# EAGLE design PIC32 (EAGLE 9.6.2)
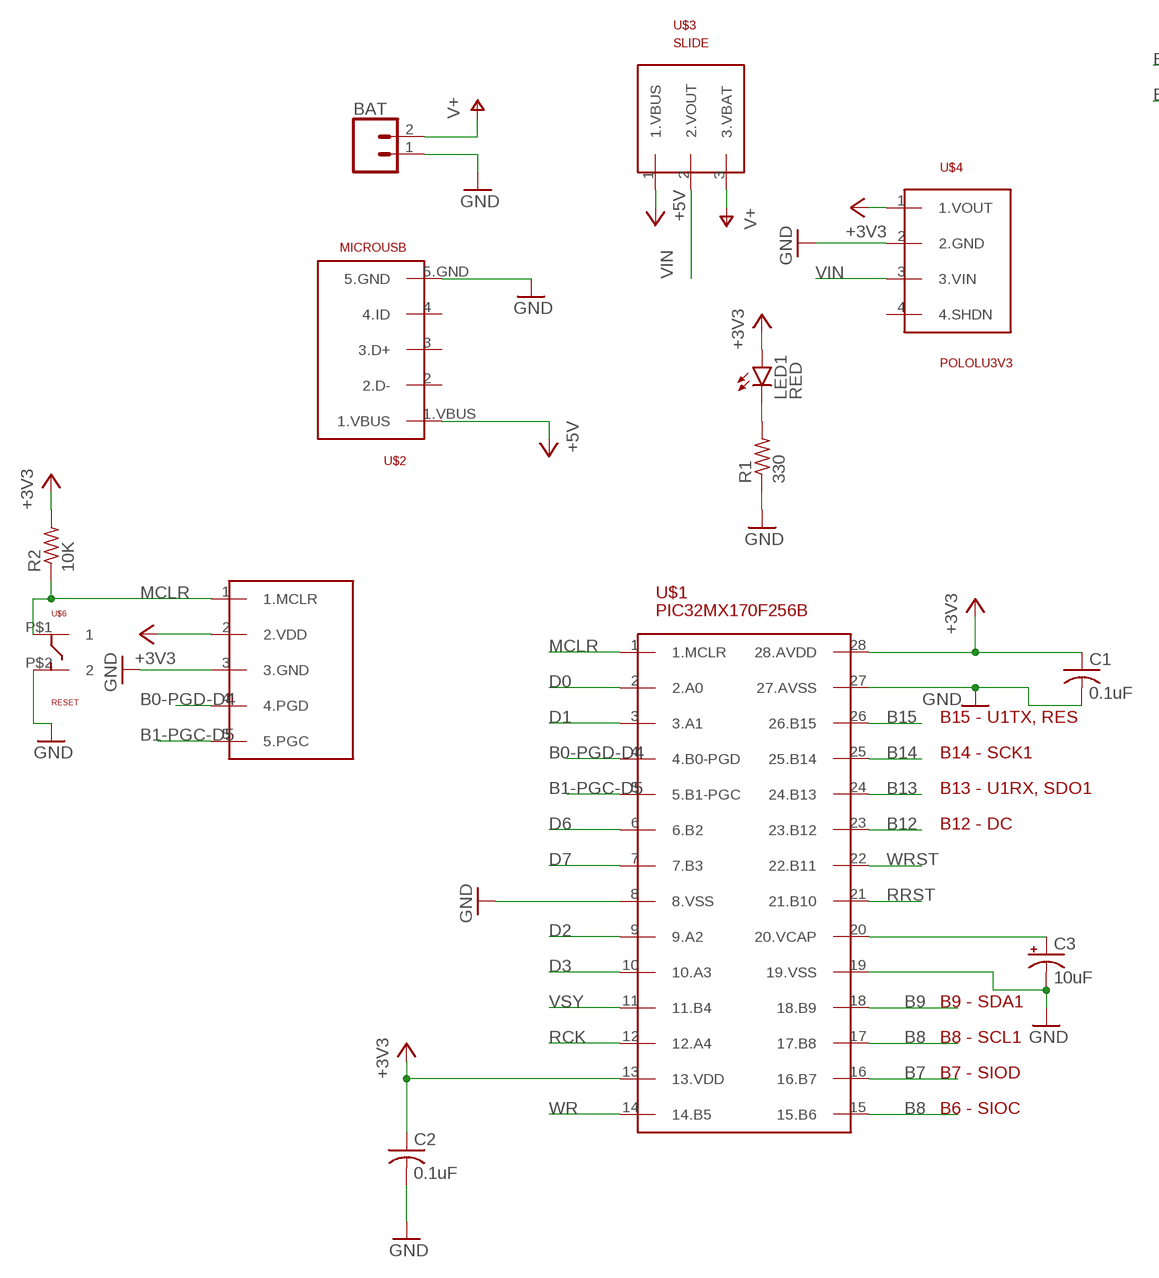
[diagram p0: schematic, sheet 1, part 1 of 2]
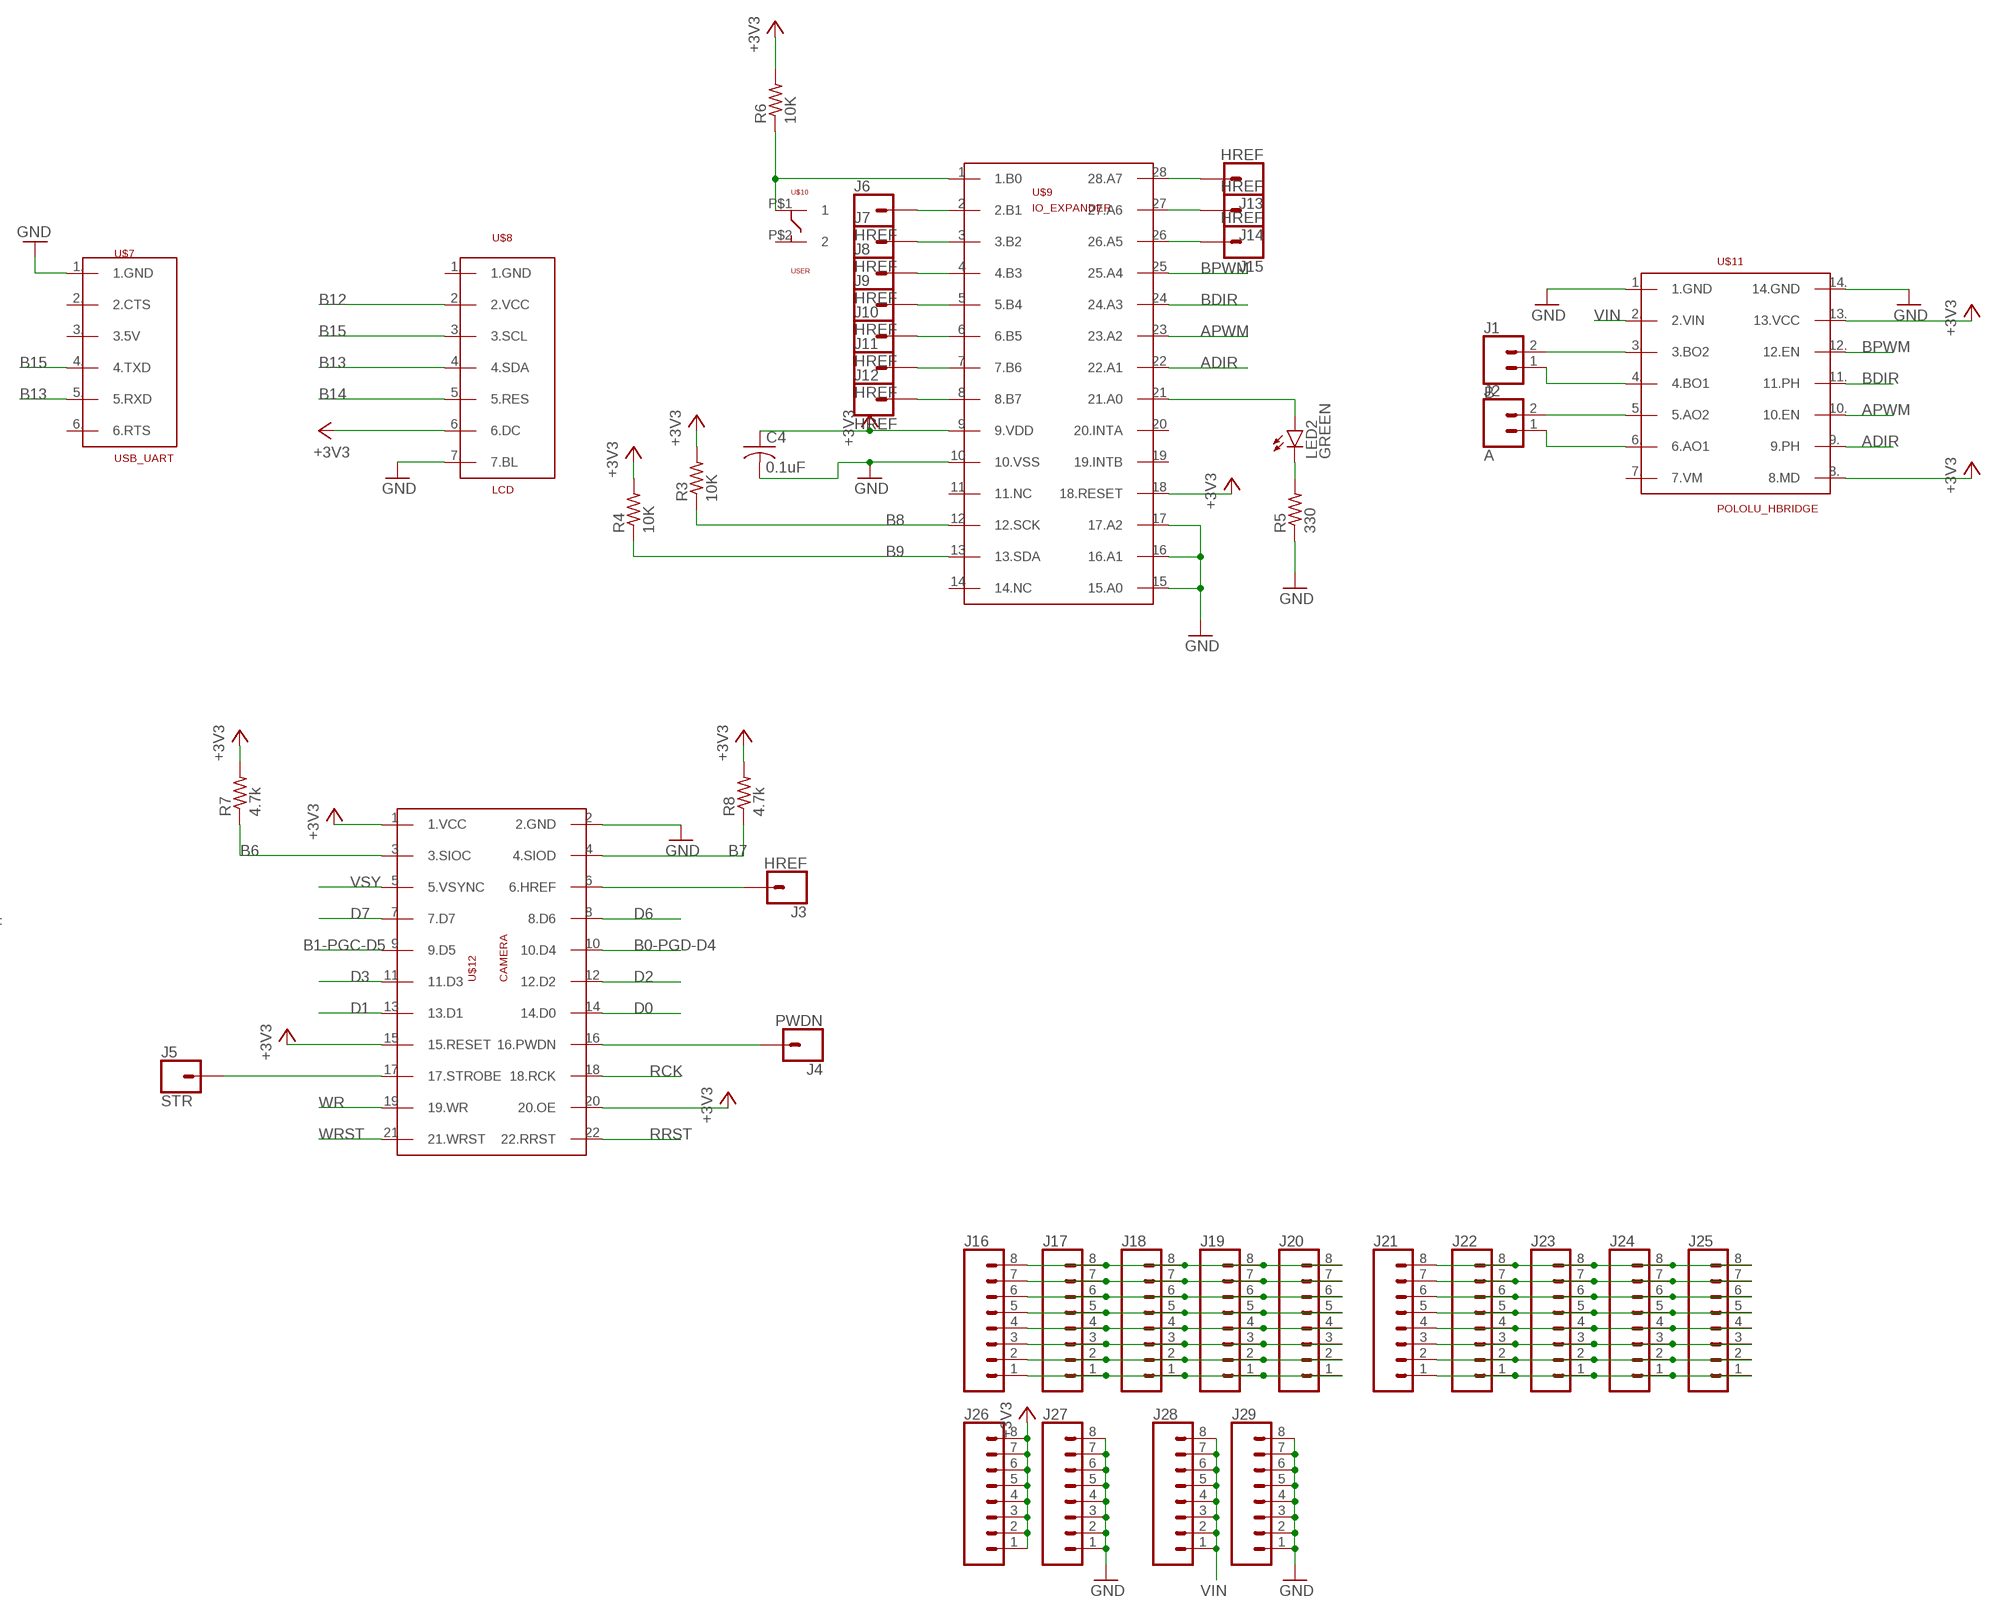
[diagram p1: schematic, sheet 1, part 2 of 2]

## Parts
BAT  CONN_02  [1X02]
C1  0.1uF  C-US025-025X050  [C025-025X050]
C2  0.1uF  C-US025-025X050  [C025-025X050]
C3  10uF  CPOL-USB45181B  [B45181B]
C4  0.1uF  C-US025-025X050  [C025-025X050]
J1  B  CONN_02  [1X02]
J2  A  CONN_02  [1X02]
J3  HREF  CONN_01  [1X01]
J4  PWDN  CONN_01  [1X01]
J5  STR  CONN_01  [1X01]
J6  HREF  CONN_01  [1X01]
J7  HREF  CONN_01  [1X01]
J8  HREF  CONN_01  [1X01]
J9  HREF  CONN_01  [1X01]
J10  HREF  CONN_01  [1X01]
J11  HREF  CONN_01  [1X01]
J12  HREF  CONN_01  [1X01]
J13  HREF  CONN_01  [1X01]
J14  HREF  CONN_01  [1X01]
J15  HREF  CONN_01  [1X01]
J16  CONN_08"  [1X08]
J17  CONN_08"  [1X08]
J18  CONN_08"  [1X08]
J19  CONN_08"  [1X08]
J20  CONN_08"  [1X08]
J21  CONN_08"  [1X08]
J22  CONN_08"  [1X08]
J23  CONN_08"  [1X08]
J24  CONN_08"  [1X08]
J25  CONN_08"  [1X08]
J26  CONN_08"  [1X08]
J27  CONN_08"  [1X08]
J28  CONN_08"  [1X08]
J29  CONN_08"  [1X08]
LED1  RED  LED3MM  [LED3MM]
LED2  GREEN  LED3MM  [LED3MM]
R1  330  R-US_0207/10  [0207/10]
R2  10K  R-US_0207/10  [0207/10]
R3  10K  R-US_0207/10  [0207/10]
R4  10K  R-US_0207/10  [0207/10]
R5  330  R-US_0207/10  [0207/10]
R6  10K  R-US_0207/10  [0207/10]
R7  4.7k  R-US_0207/10  [0207/10]
R8  4.7k  R-US_0207/10  [0207/10]
U$1  PIC32MX170F256B  [DIL28-3]
U$2  MICROUSB  [MICROUSB]
U$3  SLIDE  [SLIDE]
U$4  POLOLU3V3  [POLOLU3V3]
U$5  SNAP  [SNAP]
U$6  RESET  PUSH  [PUSH]
U$7  USB_UART  [USB_UART]
U$8  LCD  [LCD]
U$9  IO_EXPANDER  [DIL28-3]
U$10  USER  PUSH  [PUSH]
U$11  POLOLU_HBRIDGE  [POLOLU_HBRIDGE]
U$12  CAMERA  [CAMERA]

## Nets
+3V3: C1.1 C2.1 C4.1 J26.1 J26.2 J26.3 J26.4 J26.5 J26.6 J26.7 J26.8 LED1.A R2.2 R3.2 R4.2 R6.2 R7.2 R8.2 U$1.13(13.VDD) U$1.28(28.AVDD) U$4.1(1.VOUT) U$5.2(2.VDD) U$8.6.(6.DC) U$9.9(9.VDD) U$9.18(18.RESET) U$11.8.(8.MD) U$11.13.(13.VCC) U$12.1(1.VCC) U$12.15(15.RESET) U$12.20(20.OE)
+5V: U$2.1.VBUS U$3.1(1.VBUS)
ADIR: U$9.22(22.A1) U$11.9.(9.PH)
APWM: U$9.23(23.A2) U$11.10.(10.EN)
B0-PGD-D4: U$1.4(4.B0-PGD) U$5.4(4.PGD) U$12.10(10.D4)
B1-PGC-D5: U$1.5(5.B1-PGC) U$5.5(5.PGC) U$12.9(9.D5)
B6: R7.1 U$12.3(3.SIOC)
B7: R8.1 U$1.16(16.B7) U$12.4(4.SIOD)
B8: R3.1 U$1.15(15.B6) U$1.17(17.B8) U$9.12(12.SCK)
B9: R4.1 U$1.18(18.B9) U$9.13(13.SDA)
B12: U$1.23(23.B12) U$8.2.(2.VCC)
B13: U$1.24(24.B13) U$7.5.(5.RXD) U$8.4.(4.SDA)
B14: U$1.25(25.B14) U$8.5.(5.RES)
B15: U$1.26(26.B15) U$7.4.(4.TXD) U$8.3.(3.SCL)
BDIR: U$9.24(24.A3) U$11.11.(11.PH)
BPWM: U$9.25(25.A4) U$11.12.(12.EN)
D0: U$1.2(2.A0) U$12.14(14.D0)
D1: U$1.3(3.A1) U$12.13(13.D1)
D2: U$1.9(9.A2) U$12.12(12.D2)
D3: U$1.10(10.A3) U$12.11(11.D3)
D6: U$1.6(6.B2) U$12.8(8.D6)
D7: U$1.7(7.B3) U$12.7(7.D7)
GND: BAT.1 C1.2 C2.2 C3.- C4.2 J27.1 J27.2 J27.3 J27.4 J27.5 J27.6 J27.7 J27.8 J29.1 J29.2 J29.3 J29.4 J29.5 J29.6 J29.7 J29.8 R1.1 R5.1 U$1.8(8.VSS) U$1.19(19.VSS) U$1.27(27.AVSS) U$2.5.GND U$4.2(2.GND) U$5.3(3.GND) U$6.P$2 U$7.1.(1.GND) U$8.7.(7.BL) U$9.10(10.VSS) U$9.15(15.A0) U$9.16(16.A1) U$9.17(17.A2) U$11.1.(1.GND) U$11.14.(14.GND) U$12.2(2.GND)
MCLR: R2.1 U$1.1(1.MCLR) U$5.1(1.MCLR) U$6.P$1
N$1: LED1.K(C) R1.2
N$2: C3.+ U$1.20(20.VCAP)
N$3: R6.1 U$9.1(1.B0) U$10.P$1
N$4: J1.2 U$11.3.(3.BO2)
N$5: LED2.A U$9.21(21.A0)
N$6: LED2.K(C) R5.2
N$7: J1.1 U$11.4.(4.BO1)
N$8: J2.2 U$11.5.(5.AO2)
N$9: J2.1 U$11.6.(6.AO1)
N$10: J5.1 U$12.17(17.STROBE)
N$11: J4.1 U$12.16(16.PWDN)
N$12: J3.1 U$12.6(6.HREF)
N$13: J6.1 U$9.2(2.B1)
N$14: J7.1 U$9.3(3.B2)
N$15: J8.1 U$9.4(4.B3)
N$16: J9.1 U$9.5(5.B4)
N$17: J10.1 U$9.6(6.B5)
N$18: J11.1 U$9.7(7.B6)
N$19: J12.1 U$9.8(8.B7)
N$20: J15.1 U$9.26(26.A5)
N$21: J14.1 U$9.27(27.A6)
N$22: J13.1 U$9.28(28.A7)
N$23: J16.8 J17.8 J18.8 J19.8 J20.8
N$25: J16.7 J17.7 J18.7 J19.7 J20.7
N$26: J16.6 J17.6 J18.6 J19.6 J20.6
N$27: J16.5 J17.5 J18.5 J19.5 J20.5
N$28: J16.4 J17.4 J18.4 J19.4 J20.4
N$29: J16.3 J17.3 J18.3 J19.3 J20.3
N$30: J16.2 J17.2 J18.2 J19.2 J20.2
N$31: J16.1 J17.1 J18.1 J19.1 J20.1
N$32: J21.8 J22.8 J23.8 J24.8 J25.8
N$33: J21.7 J22.7 J23.7 J24.7 J25.7
N$34: J21.6 J22.6 J23.6 J24.6 J25.6
N$35: J21.5 J22.5 J23.5 J24.5 J25.5
N$36: J21.4 J22.4 J23.4 J24.4 J25.4
N$37: J21.3 J22.3 J23.3 J24.3 J25.3
N$38: J21.2 J22.2 J23.2 J24.2 J25.2
N$39: J21.1 J22.1 J23.1 J24.1 J25.1
RCK: U$1.12(12.A4) U$12.18(18.RCK)
RRST: U$1.21(21.B10) U$12.22(22.RRST)
V+: BAT.2 U$3.3(3.VBAT)
VIN: J28.1 J28.2 J28.3 J28.4 J28.5 J28.6 J28.7 J28.8 U$3.2(2.VOUT) U$4.3(3.VIN) U$11.2.(2.VIN)
VSY: U$1.11(11.B4) U$12.5(5.VSYNC)
WR: U$1.14(14.B5) U$12.19(19.WR)
WRST: U$1.22(22.B11) U$12.21(21.WRST)
Unconnected: U$2.2(2.D-) U$2.3(3.D+) U$2.4(4.ID) U$4.4(4.SHDN) U$7.2.(2.CTS) U$7.3.(3.5V) U$7.6.(6.RTS) U$8.1.(1.GND) U$9.11(11.NC) U$9.14(14.NC) U$9.19(19.INTB) U$9.20(20.INTA) U$10.P$2 U$11.7.(7.VM)

## Notes on the sheet
- B15 - U1TX, RES
- B14 - SCK1
- B13 - U1RX, SDO1
- B12 - DC
- B9 - SDA1
- B8 - SCL1
- B7 - SIOD
- B6 - SIOC

## Library data of the parts
BAT J1 J2 = PIC32:CONN_02: Multi connection point. Often used as Generic Header-pin footprint for 0.1 inch spaced/style header connections On any of the 0.1 inch spaced packages, you can populate with these: Break Away Headers - Straight <https://www.sparkfun.com/products/116> (PRT-00116) Break Away Male Headers - Right Angle <https://www.sparkfun.com/products/553> (PRT-00553) Female Headers <https://www.sparkfun.com/products/115> (PRT-00115) Break Away Headers - Machine Pin <https://www.sparkfun.com/products/117> (PRT-00117) Break Away Female Headers - Swiss Machine Pin <https://www.sparkfun.com/products/743> (PRT-00743) For SCREWTERMINALS and SPRING TERMINALS visit here: Screw Terimnals on SparkFun.com <https://www.sparkfun.com/search/results?term=Screw+Terminals> (5mm/3.5mm/2.54mm spacing) This device is also useful as a general connection point to wire up your design to another part of your project. Our various solder wires solder well into these plated through hole pads. Hook-Up Wire - Assortment (Stranded, 22 AWG) <https://www.sparkfun.com/products/11375> (PRT-11375) Hook-Up Wire - Assortment (Solid Core, 22 AWG) <https://www.sparkfun.com/products/11367> (PRT-11367) View the entire wire category on our website here <https://www.sparkfun.com/categories/141> Special notes: Molex polarized connector foot print use with: PRT-08233 with associated crimp pins and housings. 2.54_SCREWTERM for use with PRT-10571. 3.5mm Screw Terminal footprints for PRT-08084 5mm Screw Terminal footprints for use with PRT-08432
C1 C2 C4 = PIC32:C-US: CAPACITOR, American symbol; SPICEPREFIX: C
C3 = PIC32:CPOL-US: POLARIZED CAPACITOR, American symbol; SPICEPREFIX: C
J3-J15 = PIC32:CONN_01: Single connection point. Often used as Generic Header-pin footprint for 0.1 inch spaced/style header connections On any of the 0.1 inch spaced packages, you can populate with these: Break Away Headers - Straight <https://www.sparkfun.com/products/116> (PRT-00116) Break Away Male Headers - Right Angle <https://www.sparkfun.com/products/553> (PRT-00553) Female Headers <https://www.sparkfun.com/products/115> (PRT-00115) Break Away Headers - Machine Pin <https://www.sparkfun.com/products/117> (PRT-00117) Break Away Female Headers - Swiss Machine Pin <https://www.sparkfun.com/products/743> (PRT-00743) This device is also useful as a general connection point to wire up your design to another part of your project. Our various solder wires solder well into these plated through hole pads. Hook-Up Wire - Assortment (Stranded, 22 AWG) <https://www.sparkfun.com/products/11375> (PRT-11375) Hook-Up Wire - Assortment (Solid Core, 22 AWG) <https://www.sparkfun.com/products/11367> (PRT-11367) View the entire wire category on our website here <https://www.sparkfun.com/categories/141> Special notes: SMTSO-256-ET is a "flush mount" nut for a 4-40 screw. We mostly use this on specialty testbeds; it is a nice way to connect hardware to your PCB at an adjustable hieght. Also note, the SNAP packages are for using a snappable style connector. We sell a baggie of snaps and they are also used on two LilyPad designs: Snap Assortment - 30 pack (male and female) <https://www.sparkfun.com/products/11347> (DEV-11347) LilyPad Arduino SimpleSnap <https://www.sparkfun.com/products/10941> (DEV-10941) LilyPad SimpleSnap Protoboard <https://www.sparkfun.com/products/10940> (DEV-10940)
J16-J29 = PIC32:CONN_08: Multi connection point. Often used as Generic Header-pin footprint for 0.1 inch spaced/style header connections On any of the 0.1 inch spaced packages, you can populate with these: Break Away Headers - Straight <https://www.sparkfun.com/products/116> (PRT-00116) Break Away Male Headers - Right Angle <https://www.sparkfun.com/products/553> (PRT-00553) Female Headers <https://www.sparkfun.com/products/115> (PRT-00115) Break Away Headers - Machine Pin <https://www.sparkfun.com/products/117> (PRT-00117) Break Away Female Headers - Swiss Machine Pin <https://www.sparkfun.com/products/743> (PRT-00743) Arduino Stackable Header - 8 Pin <https://www.sparkfun.com/products/9279> (PRT-09279) For SCREWTERMINALS and SPRING TERMINALS visit here: Screw Terimnals on SparkFun.com <https://www.sparkfun.com/search/results?term=Screw+Terminals> (5mm/3.5mm/2.54mm spacing) This device is also useful as a general connection point to wire up your design to another part of your project. Our various solder wires solder well into these plated through hole pads. Hook-Up Wire - Assortment (Stranded, 22 AWG) <https://www.sparkfun.com/products/11375> (PRT-11375) Hook-Up Wire - Assortment (Solid Core, 22 AWG) <https://www.sparkfun.com/products/11367> (PRT-11367) View the entire wire category on our website here <https://www.sparkfun.com/categories/141> Special notes: Molex polarized connector foot print use with SKU : PRT-08231 with associated crimp pins and housings. 1MM SMD Version SKU: PRT-10208 NOTES ON THE VARIANTS LOCK and LOCK_LONGPADS... This footprint was designed to help hold the alignment of a through-hole component (i.e. 6-pin header) while soldering it into place. You may notice that each hole has been shifted either up or down by 0.005 of an inch from it's more standard position (which is a perfectly straight line). This slight alteration caused the pins (the squares in the middle) to touch the edges of the holes. Because they are alternating, it causes a "brace" to hold the component in place. 0.005 has proven to be the perfect amount of "off-center" position when using our standard breakaway headers. Although looks a little odd when you look at the bare footprint, once you have a header in there, the alteration is very hard to notice. Also,if you push a header all the way into place, it is covered up entirely on the bottom side.; PROD_ID: CONN-08438
LED1 LED2 = PIC32:LED: LED OSRAM: - CHIPLED LG R971, LG N971, LY N971, LG Q971, LY Q971, LO R971, LY R971 LH N974, LH R974 LS Q976, LO Q976, LY Q976 LO Q996 - Hyper CHIPLED LW Q18S LB Q993, LB Q99A, LB R99A - SideLED LS A670, LO A670, LY A670, LG A670, LP A670 LB A673, LV A673, LT A673, LW A673 LH A674 LY A675 LS A676, LA A676, LO A676, LY A676, LW A676 LS A679, LY A679, LG A679 - Hyper Micro SIDELED® LS Y876, LA Y876, LO Y876, LY Y876 LT Y87S - SmartLED LW L88C, LW L88S LB L89C, LB L89S, LG L890 LS L89K, LO L89K, LY L89K LS L896, LA L896, LO L896, LY L896 - TOPLED LS T670, LO T670, LY T670, LG T670, LP T670 LSG T670, LSP T670, LSY T670, LOP T670, LYG T670 LG T671, LOG T671, LSG T671 LB T673, LV T673, LT T673, LW T673 LH T674 LS T676, LA T676, LO T676, LY T676, LB T676, LH T676, LSB T676, LW T676 LB T67C, LV T67C, LT T67C, LS T67K, LO T67K, LY T67K, LW E67C LS E67B, LA E67B, LO E67B, LY E67B, LB E67C, LV E67C, LT E67C LW T67C LS T679, LY T679, LG T679 LS T770, LO T770, LY T770, LG T770, LP T770 LB T773, LV T773, LT T773, LW T773 LH T774 LS E675, LA E675, LY E675, LS T675 LS T776, LA T776, LO T776, LY T776, LB T776 LHGB T686 LT T68C, LB T68C - Hyper Mini TOPLED® LB M676 - Mini TOPLED Santana® LG M470 LS M47K, LO M47K, LY M47K Source: http://www.osram.convergy.de LUXEON: - LUMILED® LXK2-PW12-R00, LXK2-PW12-S00, LXK2-PW14-U00, LXK2-PW14-V00 LXK2-PM12-R00, LXK2-PM12-S00, LXK2-PM14-U00 LXK2-PE12-Q00, LXK2-PE12-R00, LXK2-PE12-S00, LXK2-PE14-T00, LXK2-PE14-U00 LXK2-PB12-K00, LXK2-PB12-L00, LXK2-PB12-M00, LXK2-PB14-N00, LXK2-PB14-P00, LXK2-PB14-Q00 LXK2-PR12-L00, LXK2-PR12-M00, LXK2-PR14-Q00, LXK2-PR14-R00 LXK2-PD12-Q00, LXK2-PD12-R00, LXK2-PD12-S00 LXK2-PH12-R00, LXK2-PH12-S00 LXK2-PL12-P00, LXK2-PL12-Q00, LXK2-PL12-R00 Source: www.luxeon.com KINGBRIGHT: KA-3528ASYC Source: www.kingbright.com
R1-R8 = PIC32:R-US_: RESISTOR, American symbol; SPICEPREFIX: R
U$1 = PIC32:PIC32MX170F256B
U$2 = PIC32:MICROUSB
U$3 = PIC32:SLIDE
U$4 = PIC32:POLOLU3V3
U$5 = PIC32:SNAP
U$6 U$10 = PIC32:PUSH
U$7 = PIC32:USB_UART
U$8 = PIC32:LCD
U$9 = PIC32:IO_EXPANDER
U$11 = PIC32:POLOLU_HBRIDGE
U$12 = PIC32:CAMERA

## Board
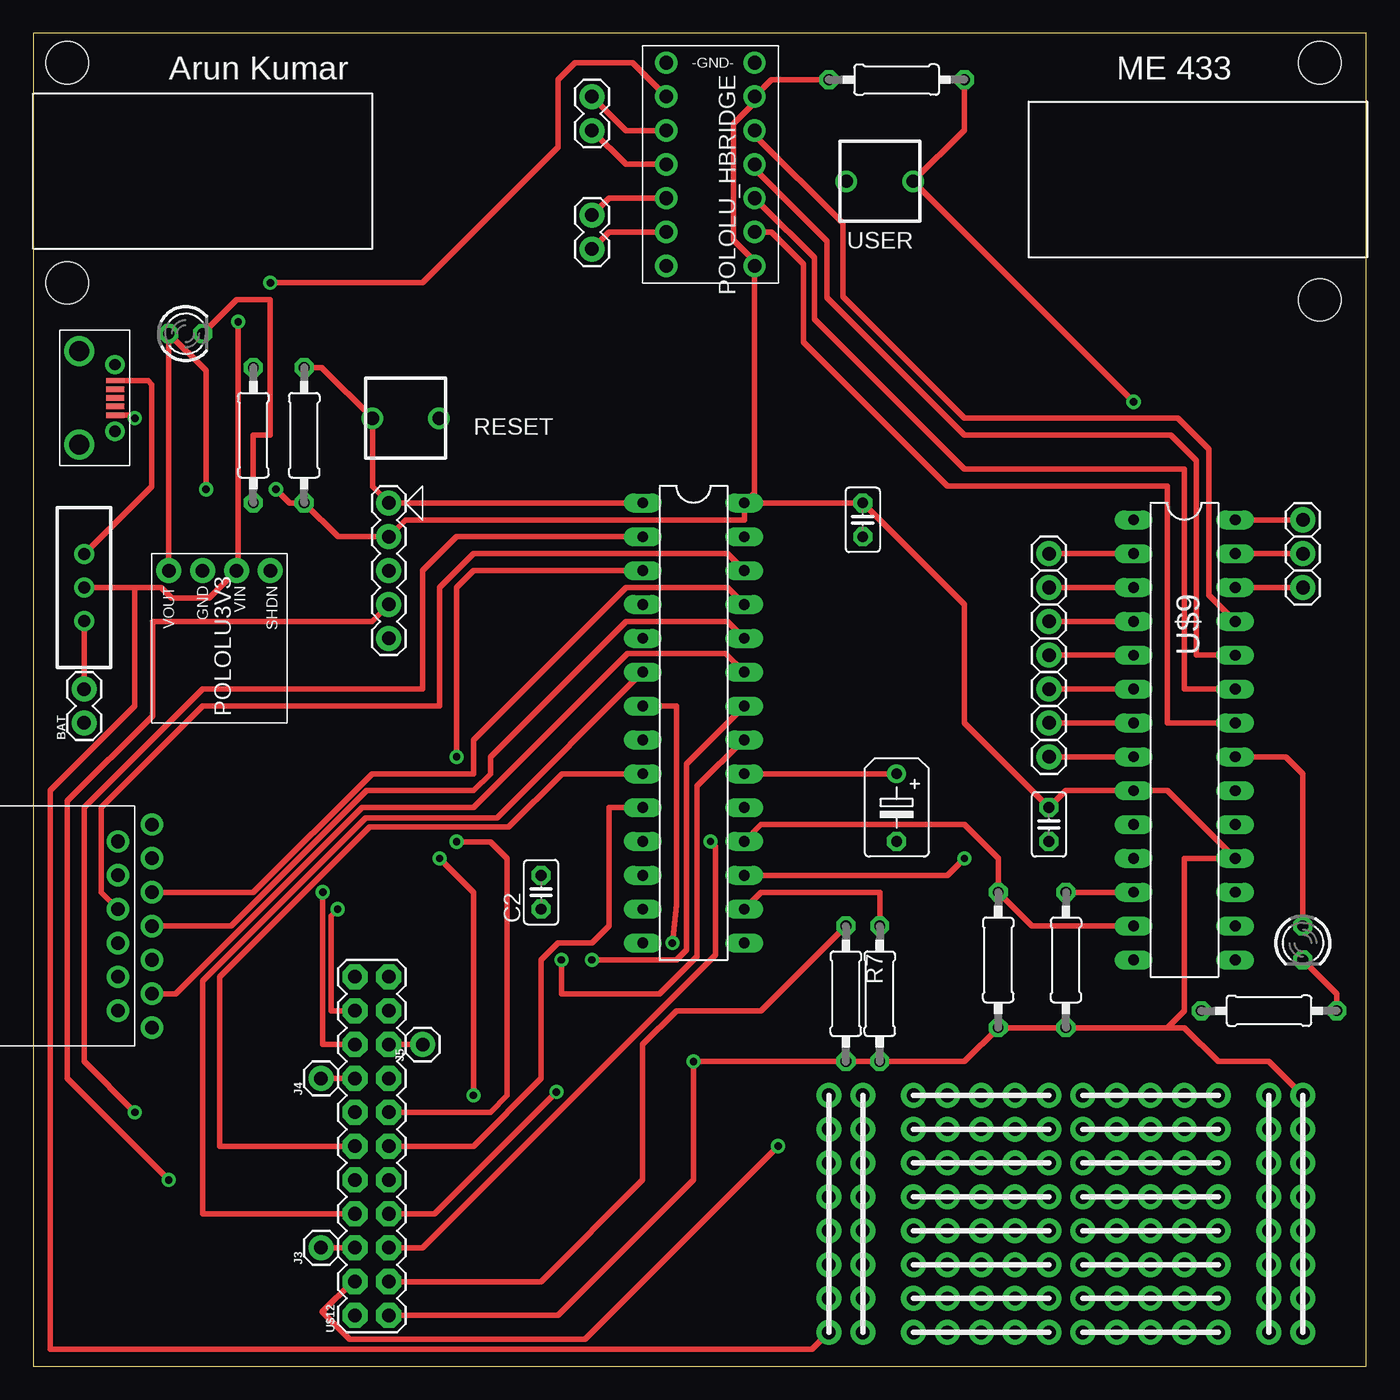
[diagram p2: board, top side]
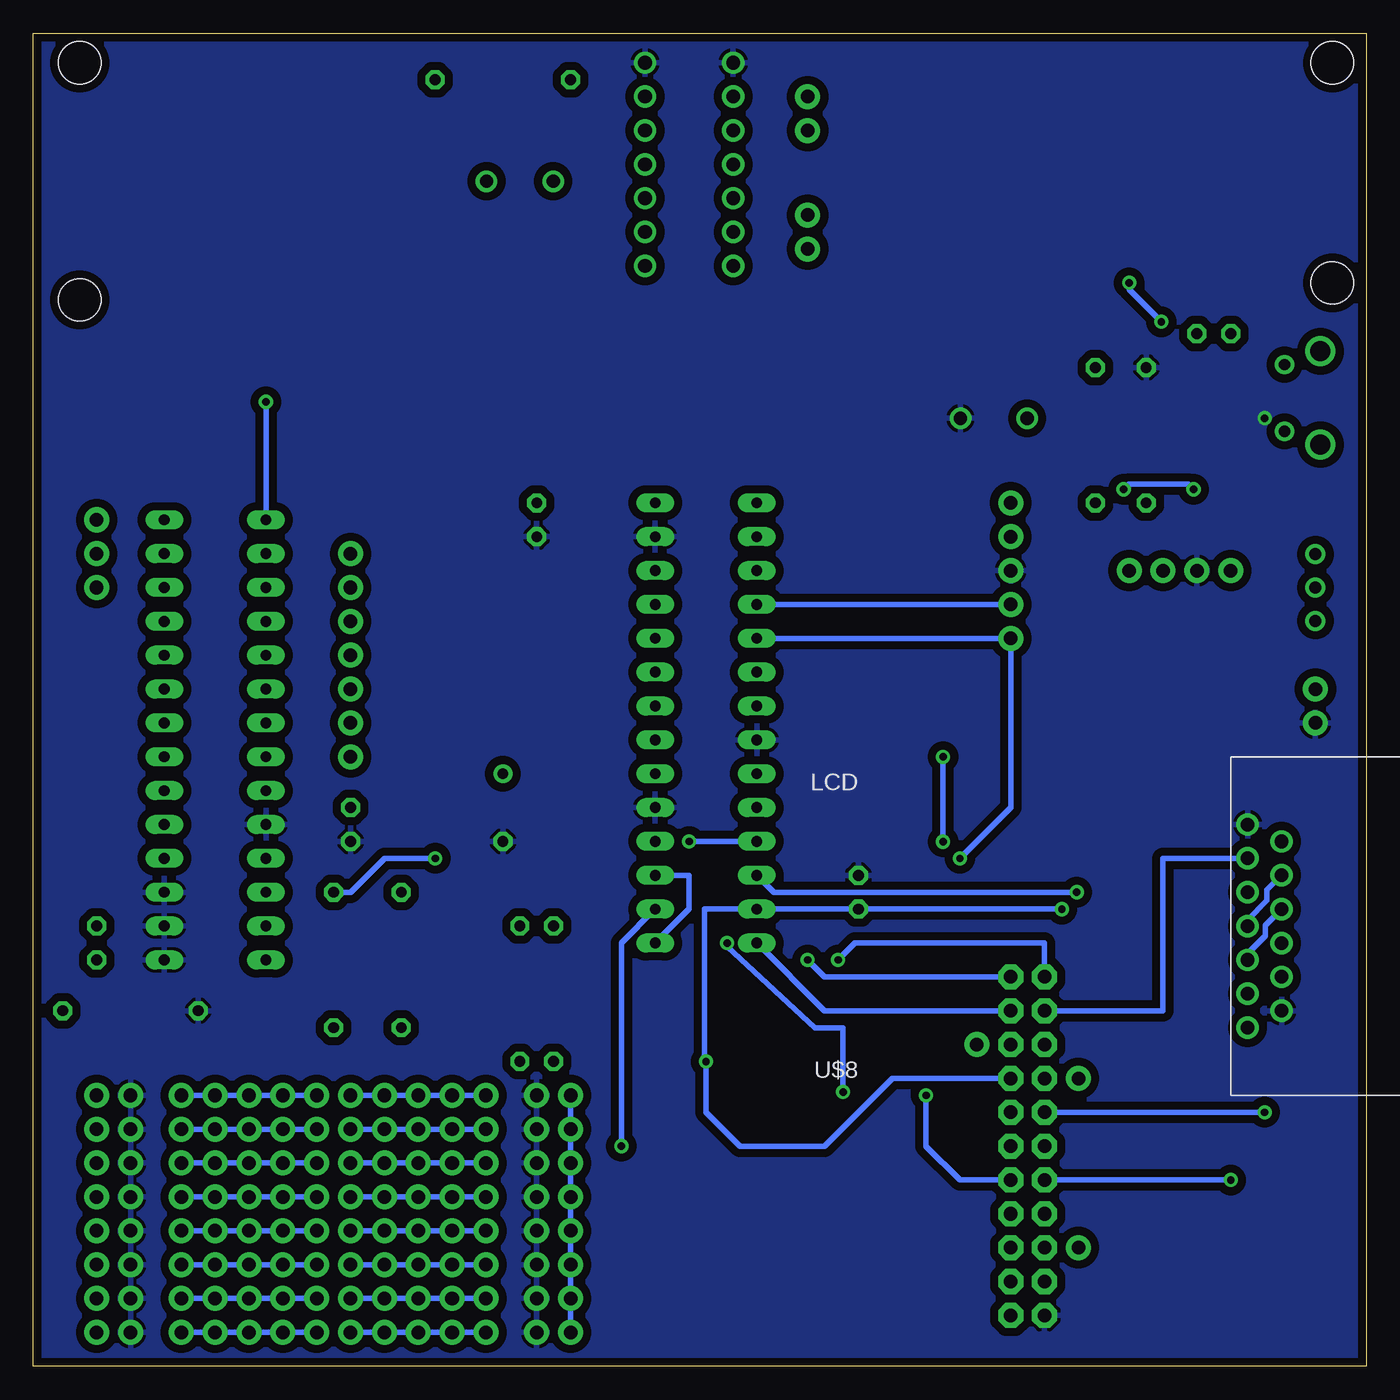
[diagram p3: board, bottom side, seen from below]

Size 100 x 100 mm. Coordinates in mm from the lower left corner, seen from the top.
Outline: 0,0 100,0 100,100 0,100 0,0
Copper layers (1*16): Top 0.035mm / dielectric 1.5mm / Bottom 0.035mm
Design rules "SparkFun": minimum track width 8mil, minimum drill 20mil, track to track 8mil, track to pad 8mil, pad to pad 8mil, via to via 8mil, smd to smd 8mil, copper to edge 8mil, drill to drill 8mil, minimum pad ring 12mil, minimum via ring 10mil, stop-mask expansion 4mil, vias tented up to drill 20mil, thermal gap 10mil
Holes 3.17 mm at 2.54,97.79 2.54,81.28 96.52,97.79 96.52,80.01

### Footprints (pad centres in the part's own frame; a part is rotated, then mirrored left to right if it is on the bottom)
1X02 = drill 1.016 pad 1.88: 1 0,0; 2 2.54,0
C025-025X050 = drill 0.813 octagon: 1 -1.27,0; 2 1.27,0
B45181B = drill 0.813: + -2.54,0 | drill 0.813 octagon: - 2.54,0
1X01 = drill 1.016 pad 1.88: 1 0,0
1X08 = drill 1.016 pad 1.88: 1 0,0; 2 2.54,0; 3 5.08,0; 4 7.62,0; 5 10.16,0; 6 12.7,0; 7 15.24,0; 8 17.78,0
LED3MM = drill 0.813 octagon: A -1.27,0; K 1.27,0
0207/10 = drill 0.813 octagon: 1 -5.08,0; 2 5.08,0
DIL28-3 = drill 0.813 long: 1 -16.51,-3.81; 2 -13.97,-3.81; 3 -11.43,-3.81; 4 -8.89,-3.81; 5 -6.35,-3.81; 6 -3.81,-3.81; 7 -1.27,-3.81; 8 1.27,-3.81; 9 3.81,-3.81; 10 6.35,-3.81; 11 8.89,-3.81; 12 11.43,-3.81; 13 13.97,-3.81; 14 16.51,-3.81; 15 16.51,3.81; 16 13.97,3.81; 17 11.43,3.81; 18 8.89,3.81; 19 6.35,3.81; 20 3.81,3.81; 21 1.27,3.81; 22 -1.27,3.81; 23 -3.81,3.81; 24 -6.35,3.81; 25 -8.89,3.81; 26 -11.43,3.81; 27 -13.97,3.81; 28 -16.51,3.81
MICROUSB = smd 0.4 x 1.35: 1.VBUS -1.3,2.7; 2 -0.65,2.7; 3 0,2.7; 4 0.64,2.7; 5.GND 1.3,2.7 | drill 0.85: P$6 -2.5,2.7; P$7 2.5,2.7 | drill 1.5: P$8 -3.5,0; P$9 3.5,0
SLIDE = drill 0.9: 1 -2.5,0; 2 0,0; 3 2.5,0
POLOLU3V3 = drill 1.016 pad 1.88: 1 0,3.81; 2 0,1.27; 3 0,-1.27; 4 0,-3.81
SNAP = drill 1.016 pad 1.88: 1 0,5.08; 2 0,2.54; 3 0,0; 4 0,-2.54; 5 0,-5.08
PUSH = drill 1: P$1 -2.5,0; P$2 2.5,0
USB_UART = drill 1.02 pad 1.676: 1. -5.08,6.35; 2. -5.08,3.81; 3. -5.08,1.27; 4. -5.08,-1.27; 5. -5.08,-3.81; 6. -5.08,-6.35
LCD = drill 1.02 pad 1.676: 1. -6.35,7.62; 2. -6.35,5.08; 3. -6.35,2.54; 4. -6.35,0; 5. -6.35,-2.54; 6. -6.35,-5.08; 7. -6.35,-7.62
POLOLU_HBRIDGE = drill 1.02 pad 1.676: 1. -3.31,7.62; 2. -3.31,5.08; 3. -3.31,2.54; 4. -3.31,0; 5. -3.31,-2.54; 6. -3.31,-5.08; 7. -3.31,-7.62; 8. 3.31,-7.62; 9. 3.31,-5.08; 10. 3.31,-2.54; 11. 3.31,0; 12. 3.31,2.54; 13. 3.31,5.08; 14. 3.31,7.62
CAMERA = drill 1.016 pad 1.88 octagon: 1 -1.27,12.7; 2 1.27,12.7; 3 -1.27,10.16; 4 1.27,10.16; 5 -1.27,7.62; 6 1.27,7.62; 7 -1.27,5.08; 8 1.27,5.08; 9 -1.27,2.54; 10 1.27,2.54; 11 -1.27,0; 12 1.27,0; 13 -1.27,-2.54; 14 1.27,-2.54; 15 -1.27,-5.08; 16 1.27,-5.08; 17 -1.27,-7.62; 18 1.27,-7.62; 19 -1.27,-10.16; 20 1.27,-10.16; 21 -1.27,-12.7; 22 1.27,-12.7

### Placement (x,y rotation side)
BAT  3.81,48.26 90 top
C1  62.23,63.5 270 top
C2  38.1,35.56 90 top
C3  64.77,41.91 270 top
C4  76.2,40.64 270 top
J1  41.91,92.71 90 top
J2  41.91,83.82 90 top
J3  21.59,8.89 90 top
J4  21.59,21.59 90 top
J5  29.21,24.13 90 top
J6  76.2,60.96 90 top
J7  76.2,58.42 90 top
J8  76.2,55.88 90 top
J9  76.2,53.34 90 top
J10  76.2,50.8 90 top
J11  76.2,48.26 90 top
J12  76.2,45.72 90 top
J13  95.25,63.5 90 top
J14  95.25,60.96 90 top
J15  95.25,58.42 90 top
J16  66.04,2.54 90 top
J17  68.58,2.54 90 top
J18  71.12,2.54 90 top
J19  73.66,2.54 90 top
J20  76.2,2.54 90 top
J21  78.74,2.54 90 top
J22  81.28,2.54 90 top
J23  83.82,2.54 90 top
J24  86.36,2.54 90 top
J25  88.9,2.54 90 top
J26  95.25,2.54 90 top
J27  62.23,2.54 90 top
J28  59.69,2.54 90 top
J29  92.71,2.54 90 top
LED1  11.43,77.47 0 top
LED2  95.25,31.75 270 top
R1  16.51,69.85 270 top
R2  20.32,69.85 270 top
R3  77.47,30.48 270 top
R4  72.39,30.48 270 top
R5  92.71,26.67 0 top
R6  64.77,96.52 180 top
R7  60.96,27.94 270 top
R8  63.5,27.94 270 top
U$1  49.53,48.26 270 top
U$2  3.43,72.64 270 top
U$3  3.81,58.42 270 top
U$4  13.97,59.69 90 top
U$5  26.67,59.69 0 top
U$6  27.94,71.12 0 top
U$7  1.27,33.02 180 top
U$8  15.24,33.02 180 bottom
U$9  86.36,46.99 270 top
U$10  63.5,88.9 180 top
U$11  50.8,90.17 0 top
U$12  25.4,16.51 180 top

### Tracks (layer width: path | path; a pad name or v marks a point on that pad's centre or on a via)
+3V3  (via drill 0.55)
  Top 0.406: U$4.1 LED1.A 12.95,74.68 v12.95,65.79 | U$1.28 53.34,63.5 27.94,63.5 U$5.2 22.86,62.23 R2.2 19.22,64.77 v18.2,65.79 | U$1.28 C1.1 69.85,57.15 69.85,48.26 C4.1 77.47,43.18 U$9.9 85.09,43.18 U$9.18 86.36,38.1 86.36,26.67 85.09,25.4 | U$1.28 54.11,65.54 U$11.8. 54.11,82.89 52.53,84.47 52.53,93.2 54.11,94.78 U$11.13. 55.38,96.52 R6.2 | 85.09,25.4 R3.2 R4.2 69.85,22.86 R8.2 R7.2 v49.53,22.86 49.53,13.97 39.37,3.81 U$12.1 | J26.1 J26.2 J26.3 J26.4 J26.5 J26.6 J26.7 J26.8 92.71,22.86 88.9,22.86 86.36,25.4 85.09,25.4 | v22.84,34.29 22.33,33.78 22.33,26.67 U$12.20
  Bottom 0.406: v12.95,65.79 13.34,66.17 17.82,66.17 v18.2,65.79 | U$8.6. 15.24,38.1 15.24,26.67 U$12.20 | v22.84,34.29 C2.1 U$1.13 49.66,34.29 49.66,22.99 v49.53,22.86 49.53,19.05 46.99,16.51 40.64,16.51 35.56,21.59 U$12.15
+5V
  Top 0.406: U$2.1.VBUS 8.61,73.94 8.89,73.66 8.89,66 U$3.1
ADIR
  Top 0.406: U$9.22 85.09,48.26 85.09,66.04 68.58,66.04 57.78,76.83 57.78,82.68 55.37,85.09 U$11.9.
APWM
  Top 0.406: U$9.23 86.36,50.8 86.36,67.31 69.85,67.31 58.6,78.56 58.6,83.16 54.61,87.15 54.61,87.63 U$11.10.
B0-PGD-D4  (via drill 0.55)
  Top 0.406: U$5.4 25.4,55.88 8.94,55.88 8.94,48.79 2.54,42.39 2.54,21.59 v10.16,13.97
  Bottom 0.406: U$5.4 U$1.4 | v10.16,13.97 U$12.10
B1-PGC-D5  (via drill 0.55)
  Top 0.406: v30.48,38.1 33.02,35.56 v33.02,20.32
  Bottom 0.406: U$1.5 U$5.5 26.67,41.91 v30.48,38.1 | v33.02,20.32 33.02,16.51 30.48,13.97 U$12.9
B6
  Top 0.406: U$12.3 38.1,6.35 45.72,13.97 45.72,24.13 48.26,26.67 54.61,26.67 R7.1
B7  (via drill 0.55)
  Top 0.406: R8.1 63.5,35.56 54.61,35.56 U$1.16 | v55.88,16.51 41.38,2.01 23.72,2.01 21.66,4.06 23.95,6.35 U$12.4
  Bottom 0.406: U$1.16 55.88,31.75 v55.88,16.51
B8  (via drill 0.55)
  Top 0.406: U$9.12 R3.1 | v69.85,38.1 68.58,36.83 U$1.17
  Bottom 0.406: R3.1 76.2,35.56 73.66,38.1 v69.85,38.1 | U$1.17 50.8,36.83 50.8,34.29 U$1.15
B9
  Top 0.406: U$1.18 54.61,40.64 69.85,40.64 72.39,38.1 R4.1 74.93,33.02 U$9.13
B12
  Top 0.406: U$1.23 51.94,53.47 44.58,53.47 33.02,41.91 24.67,41.91 10.7,27.94 U$8.2.
B13
  Top 0.406: U$1.24 52.07,55.88 44.45,55.88 34.29,45.72 34.29,44.45 33.02,43.18 25.02,43.18 14.86,33.02 U$8.4.
  Bottom 0.406: U$7.5. 7.44,35.74 7.44,34.94 8.89,33.49 U$8.4.
B14
  Top 0.406: U$1.25 52.07,58.42 44.45,58.42 33.02,46.99 33.02,44.45 25.4,44.45 16.51,35.56 U$8.5.
B15
  Top 0.406: U$1.26 52.07,60.96 33.02,60.96 30.48,58.42 30.48,49.53 12.7,49.53 5.08,41.91 5.08,35.56 U$7.4.
  Bottom 0.406: U$7.4. 7.57,33.07 7.57,32.27 8.89,30.95 U$8.3.
BDIR
  Top 0.406: U$9.24 87.25,53.34 87.25,67.94 85.34,69.85 69.85,69.85 59.54,80.16 59.54,84.4 54.11,89.83 U$11.11.
BPWM
  Top 0.406: U$9.25 88.19,57.86 88.19,68.81 85.88,71.12 69.85,71.12 60.73,80.24 60.73,85.75 54.11,92.37 U$11.12.
D0  (via drill 0.55)
  Top 0.406: U$1.2 31.75,62.23 29.21,59.69 29.21,50.8 12.7,50.8 3.81,41.91 3.81,22.86 v7.62,19.05
  Bottom 0.406: v7.62,19.05 U$12.14
D1  (via drill 0.55)
  Top 0.406: U$1.3 33.02,59.69 31.75,58.42 v31.75,45.72 | v31.75,39.35 34.31,39.35 35.56,38.1 35.56,20.32 34.29,19.05 U$12.13
  Bottom 0.406: v31.75,45.72 v31.75,39.35
D2
  Top 0.406: U$1.9 39.65,44.45 35.66,40.46 25.22,40.46 13.97,29.21 13.97,16.51 U$12.12
D3
  Top 0.406: U$12.11 33.02,16.51 38.1,21.59 38.1,30.48 39.37,31.75 41.91,31.75 43.18,33.02 43.18,41.91 U$1.10
D6
  Top 0.406: U$1.6 34.8,41.15 24.95,41.15 12.7,28.9 12.7,11.43 U$12.8
D7  (via drill 0.55)
  Top 0.406: U$1.7 48.26,49.53 48.26,34.62 v47.94,31.75 | v39.24,20.57 30.1,11.43 U$12.7
  Bottom 0.406: v47.94,31.75 47.94,31.51 41.34,25.4 39.24,25.4 v39.24,20.57
GND  (via drill 0.55)
  Top 0.406: U$2.5.GND 7.4,71.34 v7.62,71.12
  pour Bottom (isolate 0.61): 0,0 100.33,0 100.33,100.33 0,100.33
MCLR
  Top 0.406: U$1.1 U$5.1 25.44,66 U$6.P$1 21.63,74.93 R2.1
N$1
  Top 0.406: LED1.K 15.24,80.01 17.78,80.01 17.78,69.85 16.51,69.85 R1.2
N$2
  Top 0.406: U$1.20 C3.+
N$3  (via drill 0.55)
  Top 0.406: R6.1 69.85,92.75 U$10.P$1 v82.55,72.35
  Bottom 0.406: v82.55,72.35 U$9.1
N$4
  Top 0.406: U$11.3. 44.45,92.71 J1.2
N$5
  Top 0.406: U$9.21 93.98,45.72 95.25,44.45 LED2.A
N$6
  Top 0.406: LED2.K 97.79,27.94 R5.2
N$7
  Top 0.406: U$11.4. 44.45,90.17 J1.1
N$8
  Top 0.406: U$11.5. 43.18,87.63 J2.2
N$9
  Top 0.406: U$11.6. 43.18,85.09 J2.1
N$10
  Top 0.406: J5.1 U$12.17
N$11
  Top 0.406: J4.1 U$12.16
N$12
  Top 0.406: J3.1 U$12.6
N$13
  Top 0.406: U$9.2 J6.1
N$14
  Top 0.406: U$9.3 J7.1
N$15
  Top 0.406: J8.1 U$9.4
N$16
  Top 0.406: U$9.5 J9.1
N$17
  Top 0.406: J10.1 U$9.6
N$18
  Top 0.406: U$9.7 J11.1
N$19
  Top 0.406: J12.1 U$9.8
N$20
  Top 0.406: U$9.26 J15.1
N$21
  Top 0.406: U$9.27 J14.1
N$22
  Top 0.406: U$9.28 J13.1
N$23
  Bottom 0.406: J16.8 J17.8 J18.8 J19.8 J20.8
N$25
  Bottom 0.406: J16.7 J17.7 J18.7 J19.7 J20.7
N$26
  Bottom 0.406: J16.6 J17.6 J18.6 J19.6 J20.6
N$27
  Bottom 0.406: J16.5 J17.5 J18.5 J19.5 J20.5
N$28
  Bottom 0.406: J16.4 J17.4 J18.4 J19.4 J20.4
N$29
  Bottom 0.406: J16.3 J17.3 J18.3 J19.3 J20.3
N$30
  Bottom 0.406: J16.2 J17.2 J18.2 J19.2 J20.2
N$31
  Bottom 0.406: J16.1 J17.1 J18.1 J19.1 J20.1
N$32
  Bottom 0.406: J21.8 J22.8 J23.8 J24.8 J25.8
N$33
  Bottom 0.406: J21.7 J22.7 J23.7 J24.7 J25.7
N$34
  Bottom 0.406: J21.6 J22.6 J23.6 J24.6 J25.6
N$35
  Bottom 0.406: J21.5 J22.5 J23.5 J24.5 J25.5
N$36
  Bottom 0.406: J21.4 J22.4 J23.4 J24.4 J25.4
N$37
  Bottom 0.406: J21.3 J22.3 J23.3 J24.3 J25.3
N$38
  Bottom 0.406: J21.2 J22.2 J23.2 J24.2 J25.2
N$39
  Bottom 0.406: J21.1 J22.1 J23.1 J24.1 J25.1
RCK  (via drill 0.55)
  Top 0.406: v21.72,35.56 21.72,24.13 U$12.18
  Bottom 0.406: U$1.12 44.45,35.56 v21.72,35.56
RRST  (via drill 0.55)
  Top 0.406: U$1.21 53.27,46.99 49.81,43.53 49.81,30.76 46.99,27.94 39.62,27.94 v39.62,30.48
  Bottom 0.406: v39.62,30.48 38.35,31.75 24.13,31.75 U$12.22
V+
  Top 0.406: BAT.2 U$3.3
VIN  (via drill 0.55)
  Top 0.406: U$3.2 7.62,58.42 | 7.62,58.42 9.6,58.42 10.38,57.63 13.18,57.63 U$4.3 15.37,59.82 v15.37,78.36 | v17.78,81.28 29.21,81.28 39.37,91.44 39.37,96.52 40.64,97.79 44.95,97.79 U$11.2. | 7.62,58.42 7.62,49.53 1.27,43.18 1.27,1.27 58.42,1.27 J28.1
  Bottom 0.406: v15.37,78.36 17.78,80.77 v17.78,81.28 | J28.8 J28.7 J28.6 J28.5 J28.4 J28.3 J28.2 J28.1
VSY  (via drill 0.55)
  Top 0.406: U$12.5 29.21,8.89 51.18,30.86 51.18,38.99 v50.8,39.37
  Bottom 0.406: v50.8,39.37 U$1.11
WR
  Bottom 0.406: U$1.14 40.64,26.67 U$12.19
WRST  (via drill 0.55)
  Top 0.406: U$1.22 49,45.19 49,31.22 48.26,30.48 v41.91,30.48
  Bottom 0.406: v41.91,30.48 40.64,29.21 U$12.21

### Text on the board
tPlace: Arun Kumar | ME 433